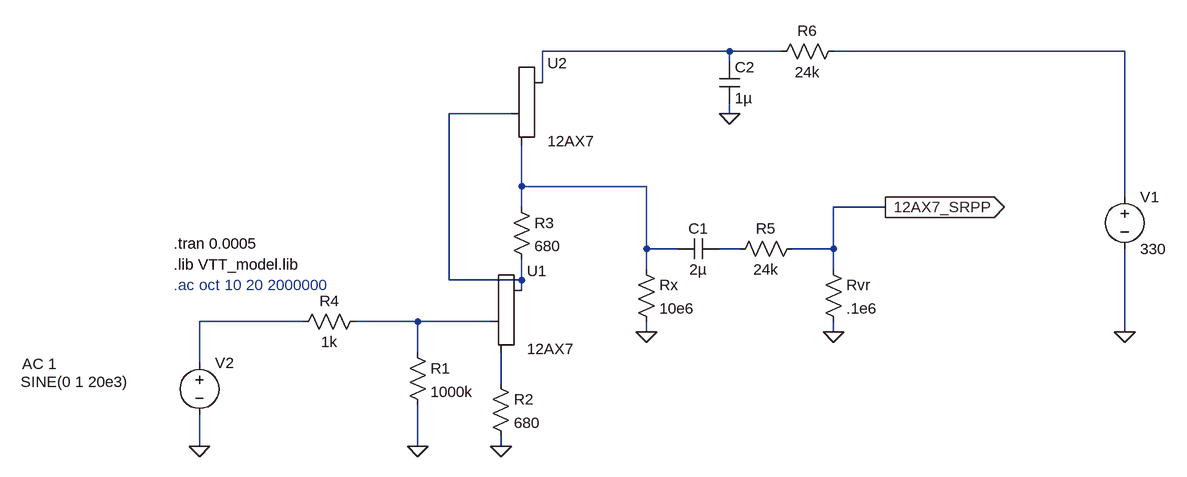
[diagram p0: schematic PreSRPP_12AX7.asc]
PreSRPP_12AX7.asc, the LTspice schematic file:
Version 4.1
SHEET 1 1160 1444
WIRE 480 240 192 240
WIRE 560 240 480 240
WIRE 1088 240 640 240
WIRE 480 256 480 240
WIRE 192 288 192 240
WIRE 144 336 48 336
WIRE 480 336 480 320
WIRE 160 448 160 384
WIRE 352 448 160 448
WIRE 1088 464 1088 240
WIRE 160 480 160 448
WIRE 720 480 640 480
WIRE 352 544 352 448
WIRE 400 544 352 544
WIRE 496 544 464 544
WIRE 640 544 640 480
WIRE 640 544 576 544
WIRE 352 576 352 544
WIRE 640 576 640 544
WIRE 48 592 48 336
WIRE 160 592 160 560
WIRE 160 592 48 592
WIRE 160 608 160 592
WIRE -176 656 -336 656
WIRE 0 656 -96 656
WIRE 112 656 0 656
WIRE 352 672 352 656
WIRE 640 672 640 656
WIRE 1088 672 1088 544
WIRE 0 704 0 656
WIRE -336 720 -336 656
WIRE 128 752 128 704
WIRE -336 848 -336 800
WIRE 0 848 0 784
WIRE 128 848 128 832
FLAG 1088 672 0
FLAG -336 848 0
FLAG 128 848 0
FLAG 0 848 0
FLAG 640 672 0
FLAG 720 480 12AX7_SRPP
IOPIN 720 480 Out
FLAG 352 672 0
FLAG 480 336 0
SYMBOL voltage 1088 448 R0
WINDOW 123 0 0 Left 0
WINDOW 39 0 0 Left 0
SYMATTR InstName V1
SYMATTR Value 330
SYMBOL voltage -336 704 R0
WINDOW 123 -273 17 Left 2
WINDOW 39 0 0 Left 0
WINDOW 3 -275 45 Left 2
SYMATTR Value2 AC 1
SYMATTR Value SINE(0 1 20e3)
SYMATTR InstName V2
SYMBOL Misc\\triode 160 656 R0
SYMATTR InstName U1
SYMATTR Value 12AX7
SYMBOL res 144 464 R0
SYMATTR InstName R3
SYMATTR Value 680
SYMBOL res 112 736 R0
SYMATTR InstName R2
SYMATTR Value 680
SYMBOL res -16 688 R0
SYMATTR InstName R1
SYMATTR Value 1000k
SYMBOL res 624 560 R0
SYMATTR InstName Rvr
SYMATTR Value .1e6
SYMBOL cap 464 528 R90
WINDOW 0 0 32 VBottom 2
WINDOW 3 32 32 VTop 2
SYMATTR InstName C1
SYMATTR Value 2µ
SYMBOL Misc\\triode 192 336 R0
SYMATTR InstName U2
SYMATTR Value 12AX7
SYMBOL res 336 560 R0
SYMATTR InstName Rx
SYMATTR Value 10e6
SYMBOL res -80 640 R90
WINDOW 0 0 56 VBottom 2
WINDOW 3 32 56 VTop 2
SYMATTR InstName R4
SYMATTR Value 1k
SYMBOL res 592 528 R90
WINDOW 0 0 56 VBottom 2
WINDOW 3 32 56 VTop 2
SYMATTR InstName R5
SYMATTR Value 24k
SYMBOL res 656 224 R90
WINDOW 0 0 56 VBottom 2
WINDOW 3 32 56 VTop 2
SYMATTR InstName R6
SYMATTR Value 24k
SYMBOL cap 464 256 R0
SYMATTR InstName C2
SYMATTR Value 1µ
TEXT -376 568 Left 2 !.lib VTT_model.lib
TEXT -376 600 Left 2 ;.ac oct 10 20 2000000
TEXT -376 536 Left 2 !.tran 0.0005

The netlist it stands for:
* PreSRPP_12AX7.asc
V1 N002 0 330
V2 N006 0 SINE(0 1 20e3) AC 1
X§U1 N003 N007 N008 12AX7
R3 N004 N003 680
R2 N008 0 680
R1 N007 0 1000k
Rvr 12AX7_SRPP 0 .1e6
C1 N005 N004 2µ
X§U2 N001 N003 N004 12AX7
Rx N004 0 10e6
R4 N007 N006 1k
R5 12AX7_SRPP N005 24k
R6 N002 N001 24k
C2 N001 0 1µ
.lib VTT_model.lib
* .ac oct 10 20 2000000
.tran 0.0005
.backanno
.end